# Altium schematic sheet 5_viper_eagle_rep-swleds.SchDoc: =ProjectTitle
size A3; Address1: github.com/4pplet/eagle_viper; Address2: Licence: CERN-OHL-S; Address4: www.4pplet.com; SheetNumber: 5; SheetTotal: 5
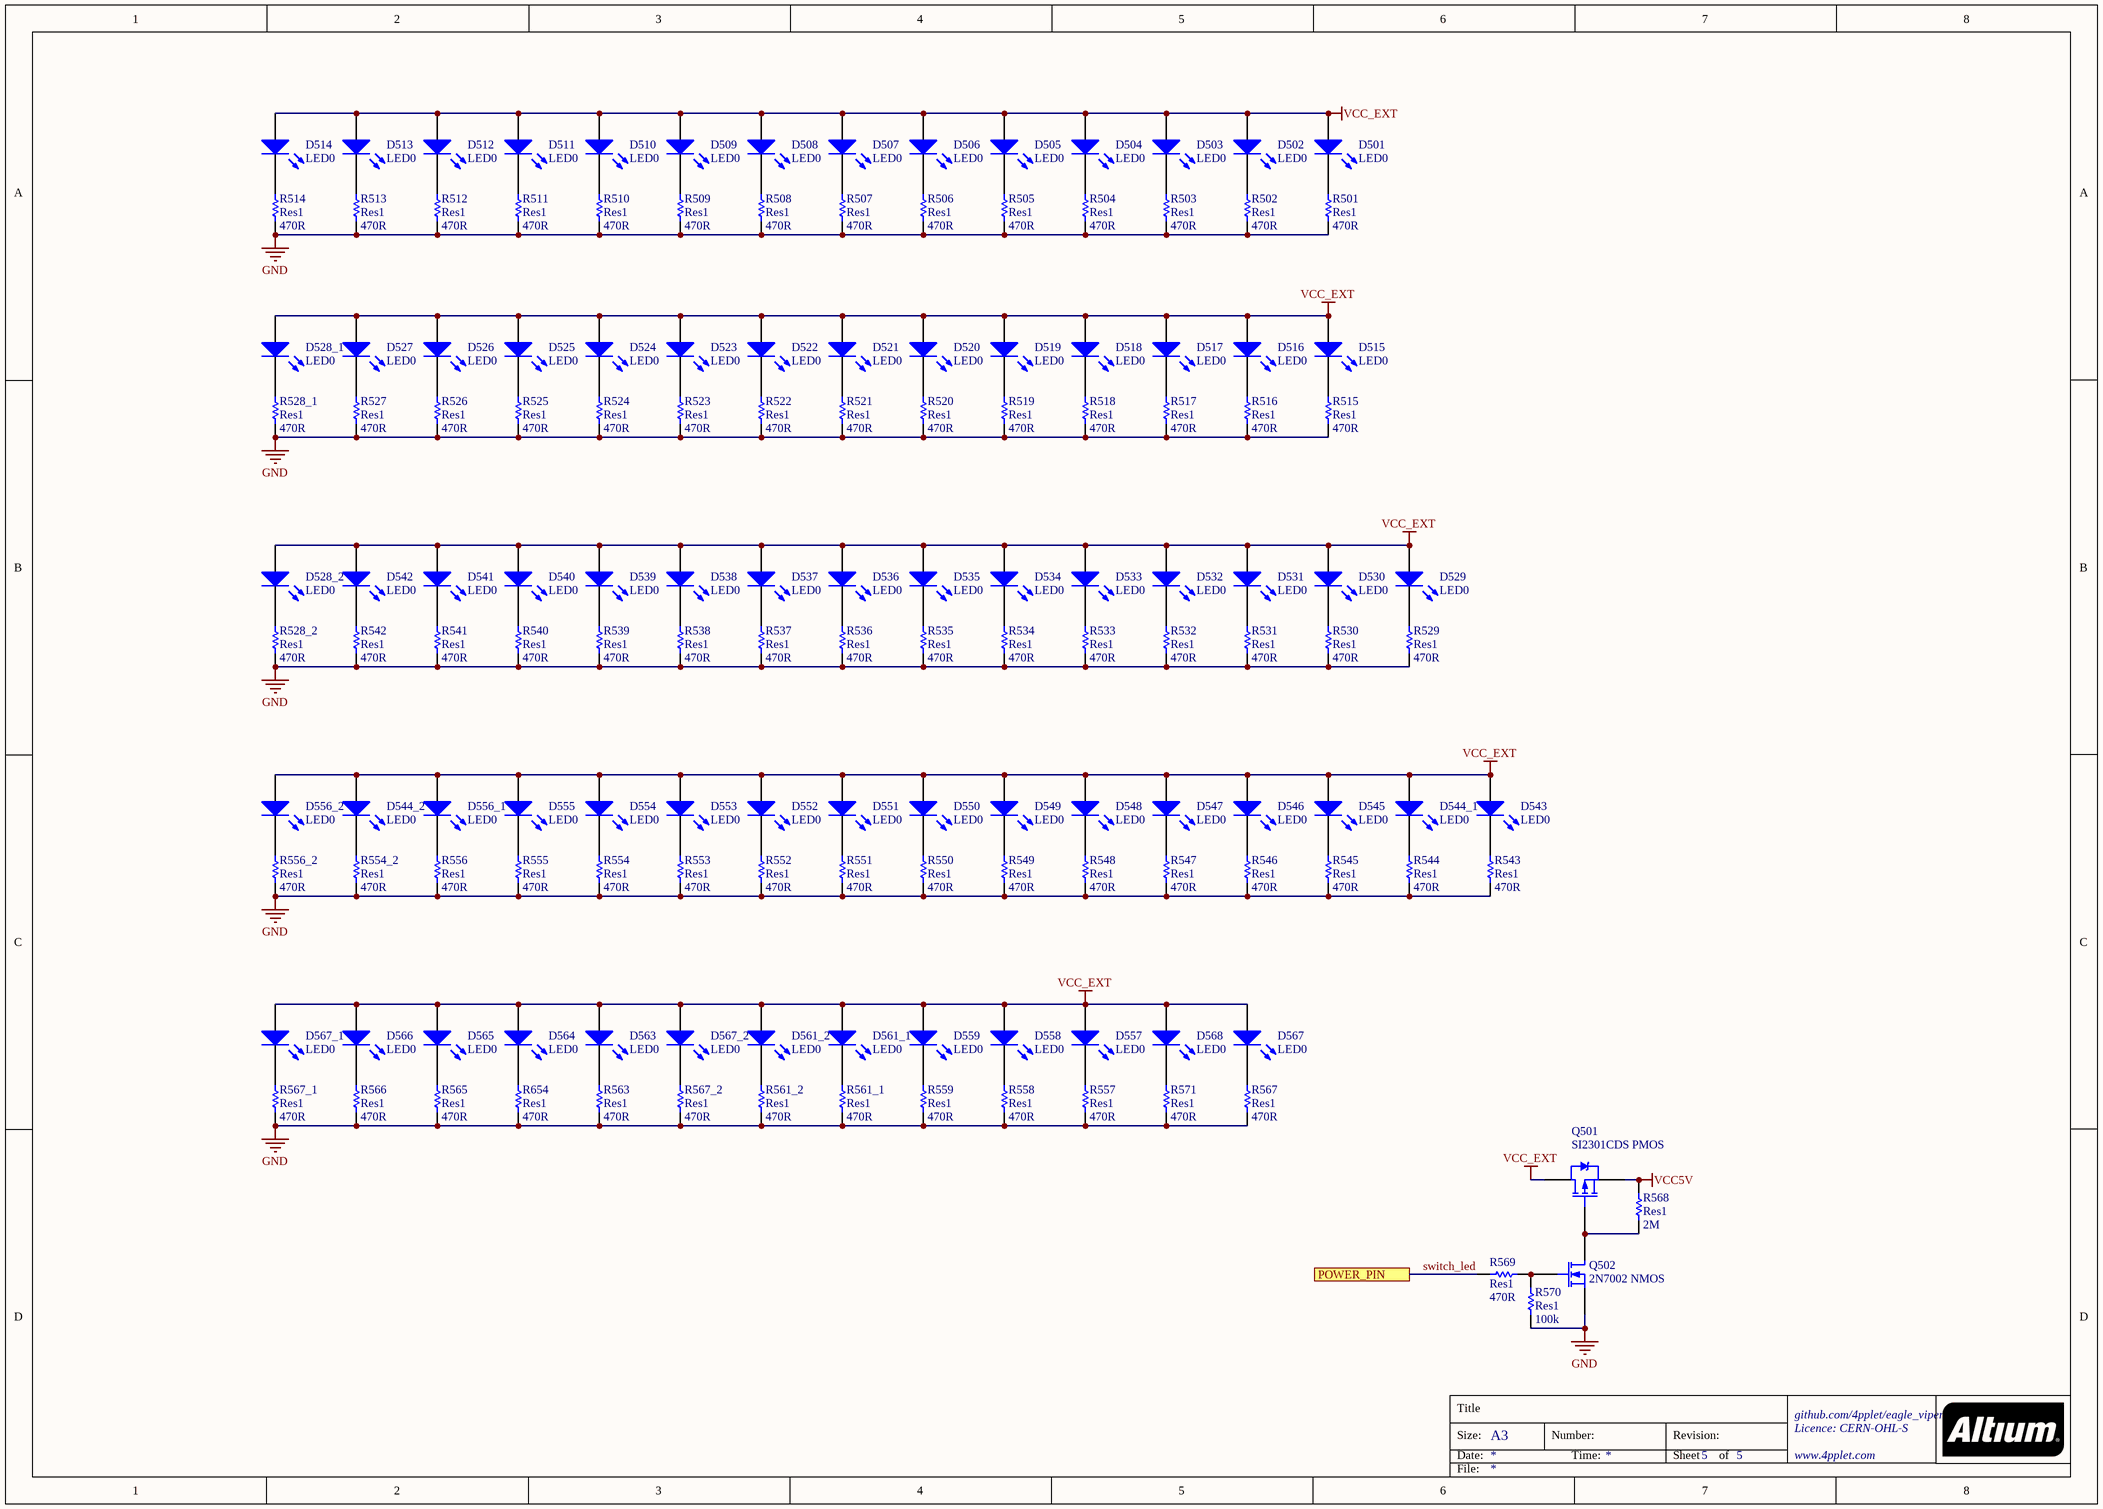
[diagram p0: 5_viper_eagle_rep-swleds.SchDoc]

## Parts
D501  LED0  [MX-switch - LED]
D502  LED0  [MX-switch - LED]
D503  LED0  [MX-switch - LED]
D504  LED0  [MX-switch - LED]
D505  LED0  [MX-switch - LED]
D506  LED0  [MX-switch - LED]
D507  LED0  [MX-switch - LED]
D508  LED0  [MX-switch - LED]
D509  LED0  [MX-switch - LED]
D510  LED0  [MX-switch - LED]
D511  LED0  [MX-switch - LED]
D512  LED0  [MX-switch - LED]
D513  LED0  [MX-switch - LED]
D514  LED0  [MX-switch - LED]
D515  LED0  [MX-switch - LED]
D516  LED0  [MX-switch - LED]
D517  LED0  [MX-switch - LED]
D518  LED0  [MX-switch - LED]
D519  LED0  [MX-switch - LED]
D520  LED0  [MX-switch - LED]
D521  LED0  [MX-switch - LED]
D522  LED0  [MX-switch - LED]
D523  LED0  [MX-switch - LED]
D524  LED0  [MX-switch - LED]
D525  LED0  [MX-switch - LED]
D526  LED0  [MX-switch - LED]
D527  LED0  [MX-switch - LED]
D528_1  LED0  [MX-switch - LED]
D528_2  LED0  [MX-switch - LED]
D529  LED0  [MX-switch - CAPS - LED NO SWITCH]
D530  LED0  [MX-switch - LED]
D531  LED0  [MX-switch - LED]
D532  LED0  [MX-switch - LED]
D533  LED0  [MX-switch - LED]
D534  LED0  [MX-switch - LED]
D535  LED0  [MX-switch - LED]
D536  LED0  [MX-switch - LED]
D537  LED0  [MX-switch - LED]
D538  LED0  [MX-switch - LED]
D539  LED0  [MX-switch - LED]
D540  LED0  [MX-switch - LED]
D541  LED0  [MX-switch - LED]
D542  LED0  [MX-switch - LED]
D543  LED0  [MX-switch - LED]
D544_1  LED0  [MX-switch - LED]
D544_2  LED0  [MX-switch - LED]
D545  LED0  [MX-switch - LED]
D546  LED0  [MX-switch - LED]
D547  LED0  [MX-switch - LED]
D548  LED0  [MX-switch - LED]
D549  LED0  [MX-switch - LED]
D550  LED0  [MX-switch - LED]
D551  LED0  [MX-switch - LED]
D552  LED0  [MX-switch - LED]
D553  LED0  [MX-switch - LED]
D554  LED0  [MX-switch - LED]
D555  LED0  [MX-switch - LED]
D556_1  LED0  [MX-switch - LED]
D556_2  LED0  [MX-switch - LED]
D557  LED0  [MX-switch - LED - MODS]
D558  LED0  [MX-switch - LED - MODS]
D559  LED0  [MX-switch - LED - MODS]
D561_1  LED0  [MX-switch - LED]
D561_2  LED0  [MX-switch - LED]
D563  LED0  [MX-switch - LED]
D564  LED0  [MX-switch - LED - MODS]
D565  LED0  [MX-switch - LED - MODS]
D566  LED0  [MX-switch - LED - MODS]
D567  LED0  [SWITCH_LED - 1U]
D567_1  LED0  [MX-switch - LED]
D567_2  LED0  [MX-switch - LED]
D568  LED0  [SWITCH_LED - 1U]
Q501  SI2301CDS PMOS  [SOT-23-3]
Q502  2N7002 NMOS  [SOT-23-3]
R501  Res1  value 470R  [R0603[1608]]
R502  Res1  value 470R  [R0603[1608]]
R503  Res1  value 470R  [R0603[1608]]
R504  Res1  value 470R  [R0603[1608]]
R505  Res1  value 470R  [R0603[1608]]
R506  Res1  value 470R  [R0603[1608]]
R507  Res1  value 470R  [R0603[1608]]
R508  Res1  value 470R  [R0603[1608]]
R509  Res1  value 470R  [R0603[1608]]
R510  Res1  value 470R  [R0603[1608]]
R511  Res1  value 470R  [R0603[1608]]
R512  Res1  value 470R  [R0603[1608]]
R513  Res1  value 470R  [R0603[1608]]
R514  Res1  value 470R  [R0603[1608]]
R515  Res1  value 470R  [R0603[1608]]
R516  Res1  value 470R  [R0603[1608]]
R517  Res1  value 470R  [R0603[1608]]
R518  Res1  value 470R  [R0603[1608]]
R519  Res1  value 470R  [R0603[1608]]
R520  Res1  value 470R  [R0603[1608]]
R521  Res1  value 470R  [R0603[1608]]
R522  Res1  value 470R  [R0603[1608]]
R523  Res1  value 470R  [R0603[1608]]
R524  Res1  value 470R  [R0603[1608]]
R525  Res1  value 470R  [R0603[1608]]
R526  Res1  value 470R  [R0603[1608]]
R527  Res1  value 470R  [R0603[1608]]
R528_1  Res1  value 470R  [R0603[1608]]
R528_2  Res1  value 470R  [R0603[1608]]
R529  Res1  value 470R  [R0603[1608]]
R530  Res1  value 470R  [R0603[1608]]
R531  Res1  value 470R  [R0603[1608]]
R532  Res1  value 470R  [R0603[1608]]
R533  Res1  value 470R  [R0603[1608]]
R534  Res1  value 470R  [R0603[1608]]
R535  Res1  value 470R  [R0603[1608]]
R536  Res1  value 470R  [R0603[1608]]
R537  Res1  value 470R  [R0603[1608]]
R538  Res1  value 470R  [R0603[1608]]
R539  Res1  value 470R  [R0603[1608]]
R540  Res1  value 470R  [R0603[1608]]
R541  Res1  value 470R  [R0603[1608]]
R542  Res1  value 470R  [R0603[1608]]
R543  Res1  value 470R  [R0603[1608]]
R544  Res1  value 470R  [R0603[1608]]
R545  Res1  value 470R  [R0603[1608]]
R546  Res1  value 470R  [R0603[1608]]
R547  Res1  value 470R  [R0603[1608]]
R548  Res1  value 470R  [R0603[1608]]
R549  Res1  value 470R  [R0603[1608]]
R550  Res1  value 470R  [R0603[1608]]
R551  Res1  value 470R  [R0603[1608]]
R552  Res1  value 470R  [R0603[1608]]
R553  Res1  value 470R  [R0603[1608]]
R554  Res1  value 470R  [R0603[1608]]
R554_2  Res1  value 470R  [R0603[1608]]
R555  Res1  value 470R  [R0603[1608]]
R556  Res1  value 470R  [R0603[1608]]
R556_2  Res1  value 470R  [R0603[1608]]
R557  Res1  value 470R  [R0603[1608]]
R558  Res1  value 470R  [R0603[1608]]
R559  Res1  value 470R  [R0603[1608]]
R561_1  Res1  value 470R  [R0603[1608]]
R561_2  Res1  value 470R  [R0603[1608]]
R563  Res1  value 470R  [R0603[1608]]
R565  Res1  value 470R  [R0603[1608]]
R566  Res1  value 470R  [R0603[1608]]
R567  Res1  value 470R  [R0603[1608]]
R567_1  Res1  value 470R  [R0603[1608]]
R567_2  Res1  value 470R  [R0603[1608]]
R568  Res1  value 2M  [R0603[1608]]
R569  Res1  value 470R  [R0603[1608]]
R570  Res1  value 100k  [R0603[1608]]
R571  Res1  value 470R  [R0603[1608]]
R654  Res1  value 470R  [R0603[1608]]

## Ports
POWER_PIN

## Nets
GND: Q502.2(S) R501.1 R502.1 R503.1 R504.1 R505.1 R506.1 R507.1 R508.1 R509.1 R510.1 R511.1 R512.1 R513.1 R514.1 R515.1 R516.1 R517.1 R518.1 R519.1 R520.1 R521.1 R522.1 R523.1 R524.1 R525.1 R526.1 R527.1 R528_1.1 R528_2.1 R529.1 R530.1 R531.1 R532.1 R533.1 R534.1 R535.1 R536.1 R537.1 R538.1 R539.1 R540.1 R541.1 R542.1 R543.1 R544.1 R545.1 R546.1 R547.1 R548.1 R549.1 R550.1 R551.1 R552.1 R553.1 R554.1 R554_2.1 R555.1 R556.1 R556_2.1 R557.1 R558.1 R559.1 R561_1.1 R561_2.1 R563.1 R565.1 R566.1 R567.1 R567_1.1 R567_2.1 R570.2 R571.1 R654.1
VCC5V: Q501.2(S) R568.2
VCC_EXT: D501.1(A) D502.1(A) D503.1(A) D504.1(A) D505.1(A) D506.1(A) D507.1(A) D508.1(A) D509.1(A) D510.1(A) D511.1(A) D512.1(A) D513.1(A) D514.1(A) D515.1(A) D516.1(A) D517.1(A) D518.1(A) D519.1(A) D520.1(A) D521.1(A) D522.1(A) D523.1(A) D524.1(A) D525.1(A) D526.1(A) D527.1(A) D528_1.1(A) D528_2.1(A) D529.1(A) D530.1(A) D531.1(A) D532.1(A) D533.1(A) D534.1(A) D535.1(A) D536.1(A) D537.1(A) D538.1(A) D539.1(A) D540.1(A) D541.1(A) D542.1(A) D543.1(A) D544_1.1(A) D544_2.1(A) D545.1(A) D546.1(A) D547.1(A) D548.1(A) D549.1(A) D550.1(A) D551.1(A) D552.1(A) D553.1(A) D554.1(A) D555.1(A) D556_1.1(A) D556_2.1(A) D557.1(A) D558.1(A) D559.1(A) D561_1.1(A) D561_2.1(A) D563.1(A) D564.1(A) D565.1(A) D566.1(A) D567.1(A) D567_1.1(A) D567_2.1(A) D568.1(A) Q501.3(D)
switch_led: R569.1 ; port POWER_PIN
NetD501_2: D501.2(K) R501.2
NetD502_2: D502.2(K) R502.2
NetD503_2: D503.2(K) R503.2
NetD504_2: D504.2(K) R504.2
NetD505_2: D505.2(K) R505.2
NetD506_2: D506.2(K) R506.2
NetD507_2: D507.2(K) R507.2
NetD508_2: D508.2(K) R508.2
NetD509_2: D509.2(K) R509.2
NetD510_2: D510.2(K) R510.2
NetD511_2: D511.2(K) R511.2
NetD512_2: D512.2(K) R512.2
NetD513_2: D513.2(K) R513.2
NetD514_2: D514.2(K) R514.2
NetD515_2: D515.2(K) R515.2
NetD516_2: D516.2(K) R516.2
NetD517_2: D517.2(K) R517.2
NetD518_2: D518.2(K) R518.2
NetD519_2: D519.2(K) R519.2
NetD520_2: D520.2(K) R520.2
NetD521_2: D521.2(K) R521.2
NetD522_2: D522.2(K) R522.2
NetD523_2: D523.2(K) R523.2
NetD524_2: D524.2(K) R524.2
NetD525_2: D525.2(K) R525.2
NetD526_2: D526.2(K) R526.2
NetD527_2: D527.2(K) R527.2
NetD528_1_2: D528_1.2(K) R528_1.2
NetD528_2_2: D528_2.2(K) R528_2.2
NetD529_2: D529.2(K) R529.2
NetD530_2: D530.2(K) R530.2
NetD531_2: D531.2(K) R531.2
NetD532_2: D532.2(K) R532.2
NetD533_2: D533.2(K) R533.2
NetD534_2: D534.2(K) R534.2
NetD535_2: D535.2(K) R535.2
NetD536_2: D536.2(K) R536.2
NetD537_2: D537.2(K) R537.2
NetD538_2: D538.2(K) R538.2
NetD539_2: D539.2(K) R539.2
NetD540_2: D540.2(K) R540.2
NetD541_2: D541.2(K) R541.2
NetD542_2: D542.2(K) R542.2
NetD543_2: D543.2(K) R543.2
NetD544_1_2: D544_1.2(K) R544.2
NetD544_2_2: D544_2.2(K) R554_2.2
NetD545_2: D545.2(K) R545.2
NetD546_2: D546.2(K) R546.2
NetD547_2: D547.2(K) R547.2
NetD548_2: D548.2(K) R548.2
NetD549_2: D549.2(K) R549.2
NetD550_2: D550.2(K) R550.2
NetD551_2: D551.2(K) R551.2
NetD552_2: D552.2(K) R552.2
NetD553_2: D553.2(K) R553.2
NetD554_2: D554.2(K) R554.2
NetD555_2: D555.2(K) R555.2
NetD556_1_2: D556_1.2(K) R556.2
NetD556_2_2: D556_2.2(K) R556_2.2
NetD557_2: D557.2(K) R557.2
NetD558_2: D558.2(K) R558.2
NetD559_2: D559.2(K) R559.2
NetD561_1_2: D561_1.2(K) R561_1.2
NetD561_2_2: D561_2.2(K) R561_2.2
NetD563_2: D563.2(K) R563.2
NetD564_2: D564.2(K) R654.2
NetD565_2: D565.2(K) R565.2
NetD566_2: D566.2(K) R566.2
NetD567_1_2: D567_1.2(K) R567_1.2
NetD567_2: D567.2(K) R567.2
NetD567_2_2: D567_2.2(K) R567_2.2
NetD568_2: D568.2(K) R571.2
NetQ501_1: Q501.1(G) Q502.3(D) R568.1
NetQ502_1: Q502.1(G) R569.2 R570.1

## Notes on the sheet
- Title
- Size:
- Date:
- A3
- Number:
- Time:
- Revision:
- Sheet
- of
- File:

## Library data of the parts
D501-D527 D528_1 D528_2 D529-D543 D544_1 D544_2 D545-D555 D556_1 D556_2 D557-D559 D561_1 D561_2 D563-D567 D567_1 D567_2 D568 = LED0: Typical INFRARED GaAs LED
Q501 = PMOS-2: P-Channel Power MOSFET; MRF.Part: SI2301CDS-T1-GE3; LCSC MFG: Vishay Intertech; LCSC Part #: C10487; Version: SOT23-3
Q502 = MOSFET-N: N-Channel MOSFET; LCSC MFG: Changjiang Electronics Tech (CJ); LCSC Part #: C8545; MRF.Part: 2N7002
R501-R527 R528_1 R528_2 R529-R554 R554_2 R555 R556 R556_2 R557-R559 R561_1 R561_2 R563 R565-R567 R567_1 R567_2 R569 R571 R654 = Res1: Resistor; MRF.Part: 0603WAF4700T5E; LCSC MFG: Uniroyal Elec; Version: 0603 imperial; LCSC Part #: C23179
R568 = Res1: Resistor; MRF.Part: 0603WAF2004T5E; LCSC MFG: Uniroyal Elec; Version: 0603 imperial; LCSC Part #: C22976
R570 = Res1: Resistor; MRF.Part: 0603WAF1003T5E; LCSC MFG: Uniroyal Elec; Version: 0603 imperial; LCSC Part #: C25803